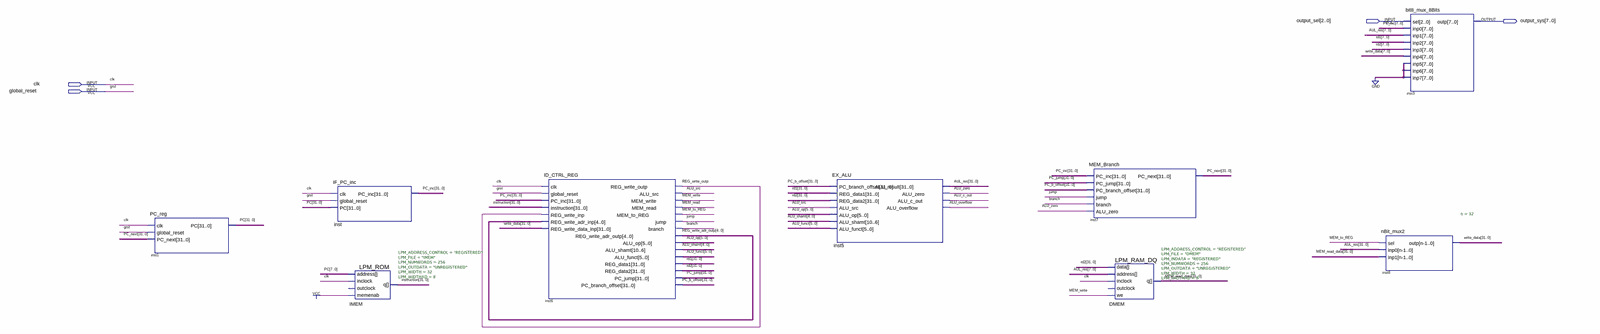
[diagram p0: schematic sheet, whole]
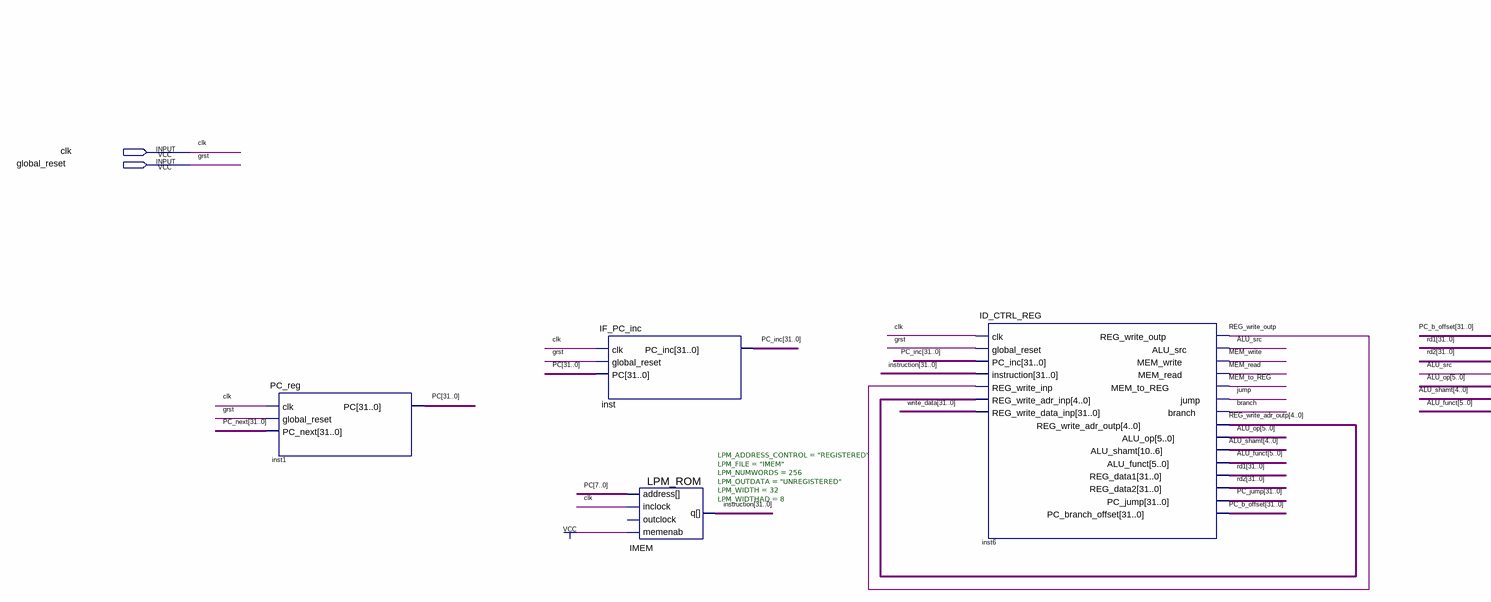
[diagram p1: schematic sheet, left part]
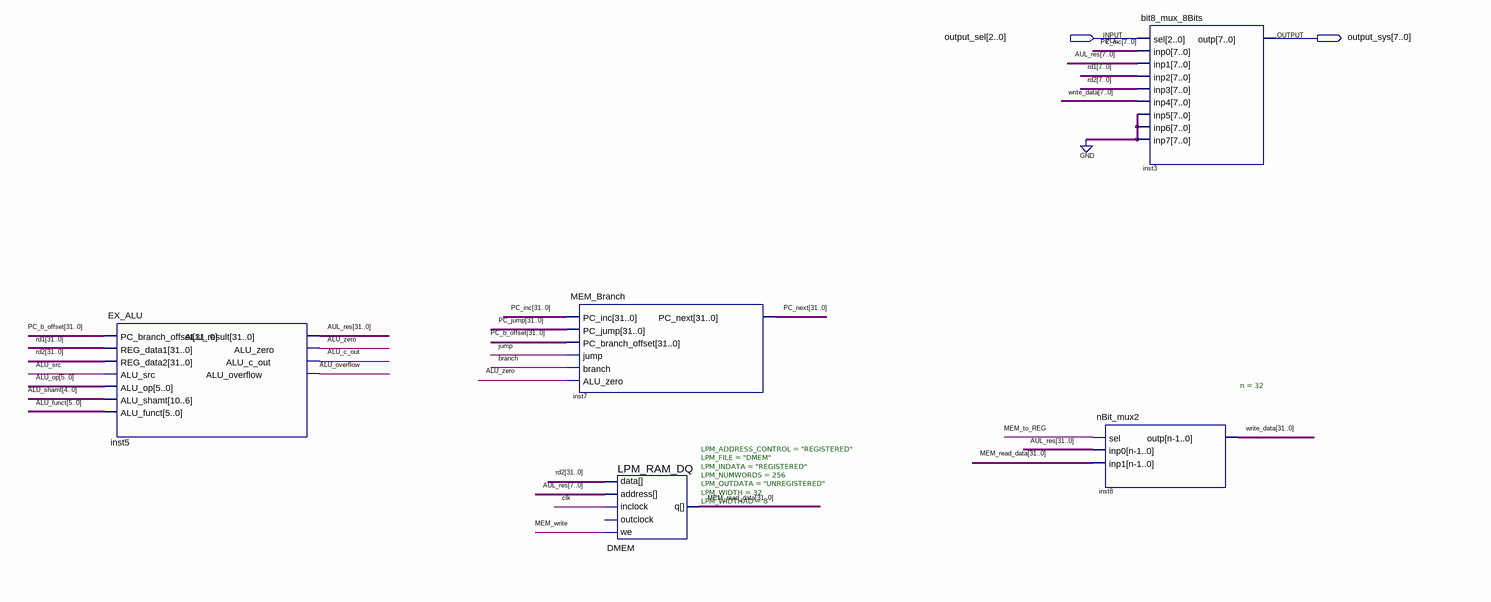
[diagram p2: schematic sheet, right part]
// Quartus schematic top_level.bdf as structural Verilog: 9 symbols, 4 pins
module top_level (
  input  [2:0] output_sel,
  input  clk,
  input  global_reset,
  output [7:0] output_sys
);

  wire ALU_c_out, ALU_overflow, ALU_src, ALU_zero, branch, jump, MEM_read, MEM_to_REG, MEM_write,
       REG_write_outp;
  wire [4:0] ALU_shamt, REG_write_adr_outp;
  wire [5:0] ALU_funct, ALU_op;
  wire [31:0] AUL_res, instruction, MEM_read_data, PC, PC_b_offset, PC_inc, PC_jump, PC_next, rd1, rd2,
       write_data;

  PC_reg inst1 (.clk(clk), .global_reset(global_reset), .PC_next(PC_next), .PC(PC));
  IF_PC_inc inst (.clk(clk), .global_reset(global_reset), .PC(PC), .PC_inc(PC_inc));
  LPM_ROM #(.LPM_ADDRESS_CONTROL("REGISTERED"), .LPM_FILE("IMEM"), .LPM_NUMWORDS(256), .LPM_OUTDATA("UNREGISTERED"), .LPM_WIDTH(32), .LPM_WIDTHAD(8)) IMEM (
    .address(PC[7:0]), .inclock(clk), .memenab(1'b1), .q(instruction));  // open: outclock
  ID_CTRL_REG inst6 (
    .clk(clk), .global_reset(global_reset), .PC_inc(PC_inc), .instruction(instruction),
    .REG_write_inp(REG_write_outp), .REG_write_adr_inp(REG_write_adr_outp), .REG_write_data_inp(write_data),
    .REG_write_outp(REG_write_outp), .ALU_src(ALU_src), .MEM_write(MEM_write), .MEM_read(MEM_read),
    .MEM_to_REG(MEM_to_REG), .jump(jump), .branch(branch), .REG_write_adr_outp(REG_write_adr_outp),
    .ALU_op(ALU_op), .ALU_shamt(ALU_shamt), .ALU_funct(ALU_funct), .REG_data1(rd1), .REG_data2(rd2),
    .PC_jump(PC_jump), .PC_branch_offset(PC_b_offset));
  EX_ALU inst5 (
    .PC_branch_offset(PC_b_offset), .REG_data1(rd1), .REG_data2(rd2), .ALU_src(ALU_src), .ALU_op(ALU_op),
    .ALU_shamt(ALU_shamt), .ALU_funct(ALU_funct), .ALU_result(AUL_res), .ALU_zero(ALU_zero),
    .ALU_c_out(ALU_c_out), .ALU_overflow(ALU_overflow));
  MEM_Branch inst7 (
    .PC_inc(PC_inc), .PC_jump(PC_jump), .PC_branch_offset(PC_b_offset), .jump(jump), .branch(branch),
    .ALU_zero(ALU_zero), .PC_next(PC_next));
  LPM_RAM_DQ #(.LPM_ADDRESS_CONTROL("REGISTERED"), .LPM_FILE("DMEM"), .LPM_INDATA("REGISTERED"), .LPM_NUMWORDS(256), .LPM_OUTDATA("UNREGISTERED"), .LPM_WIDTH(32), .LPM_WIDTHAD(8)) DMEM (
    .inclock(clk), .data(rd2), .address(AUL_res[7:0]), .we(MEM_write), .q(MEM_read_data));  // open: outclock
  nBit_mux2 #(.n(32)) inst8 (.sel(MEM_to_REG), .inp0(AUL_res), .inp1(MEM_read_data), .outp(write_data));
  bit8_mux_8Bits inst3 (
    .sel(output_sel), .inp0(PC_inc[7:0]), .inp1(AUL_res[7:0]), .inp2(rd1[7:0]), .inp3(rd2[7:0]),
    .inp4(write_data[7:0]), .inp5({8{1'b0}}), .inp6({8{1'b0}}), .inp7({8{1'b0}}), .outp(output_sys));

  // Other names for the same wires on the sheet: grst = global_reset
endmodule
